# Altium schematic sheet percepcao_externa_sensores.SchDoc
size A4; SheetNumber: 4; SheetTotal: 4
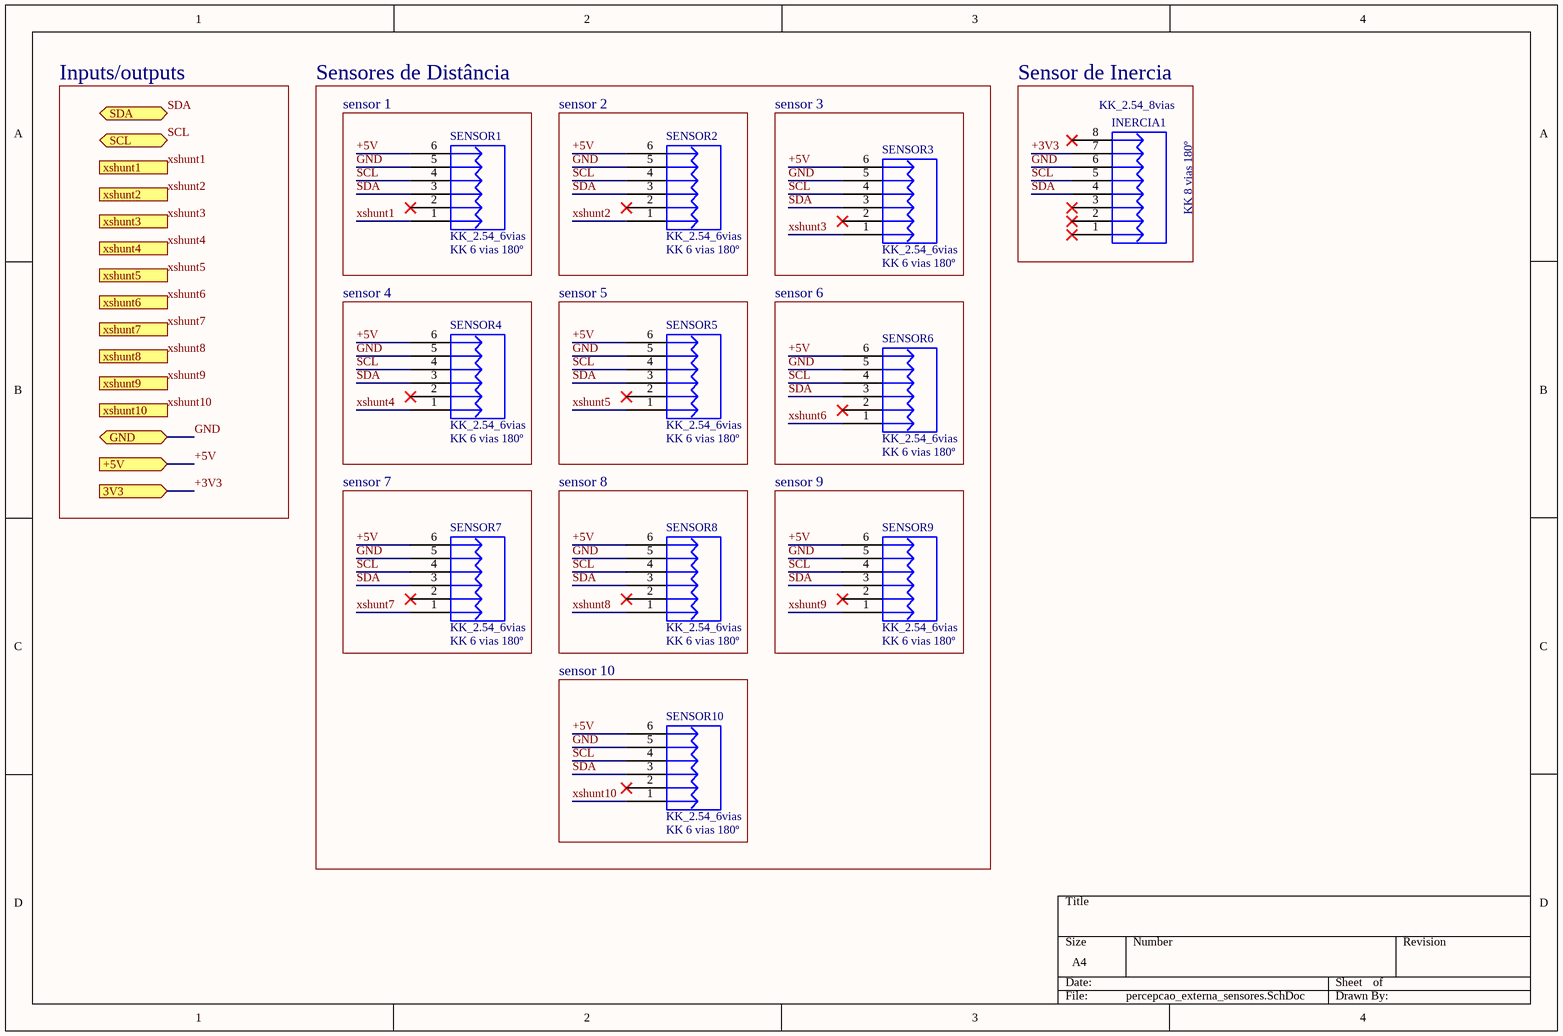
[diagram p0: percepcao_externa_sensores.SchDoc]

## Parts
INERCIA1  KK_2.54_8vias  Valor: KK 8 vias 180º  [KK_8vias_180°]
SENSOR1  KK_2.54_6vias  Valor: KK 6 vias 180º  [KK_6vias_180°]
SENSOR2  KK_2.54_6vias  Valor: KK 6 vias 180º  [KK_6vias_180°]
SENSOR3  KK_2.54_6vias  Valor: KK 6 vias 180º  [KK_6vias_180°]
SENSOR4  KK_2.54_6vias  Valor: KK 6 vias 180º  [KK_6vias_180°]
SENSOR5  KK_2.54_6vias  Valor: KK 6 vias 180º  [KK_6vias_180°]
SENSOR6  KK_2.54_6vias  Valor: KK 6 vias 180º  [KK_6vias_180°]
SENSOR7  KK_2.54_6vias  Valor: KK 6 vias 180º  [KK_6vias_180°]
SENSOR8  KK_2.54_6vias  Valor: KK 6 vias 180º  [KK_6vias_180°]
SENSOR9  KK_2.54_6vias  Valor: KK 6 vias 180º  [KK_6vias_180°]
SENSOR10  KK_2.54_6vias  Valor: KK 6 vias 180º  [KK_6vias_180°]

## Blocks framed on the sheet
Sensor de Inercia: INERCIA1
sensor 1: SENSOR1
sensor 2: SENSOR2
sensor 3: SENSOR3
sensor 4: SENSOR4
sensor 5: SENSOR5
sensor 6: SENSOR6
sensor 7: SENSOR7
sensor 8: SENSOR8
sensor 9: SENSOR9
sensor 10: SENSOR10

## Ports
3V3 (in), +5V (in), GND (bidir), SCL (bidir), SDA (bidir), xshunt1 (in), xshunt2 (in), xshunt3 (in), xshunt4 (in), xshunt5 (in), xshunt6 (in), xshunt7 (in), xshunt8 (in), xshunt9 (in), xshunt10 (in)

## Nets
+3V3: INERCIA1.7 ; port 3V3
+5V: SENSOR1.6 SENSOR2.6 SENSOR3.6 SENSOR4.6 SENSOR5.6 SENSOR6.6 SENSOR7.6 SENSOR8.6 SENSOR9.6 SENSOR10.6 ; port +5V
GND: INERCIA1.6 SENSOR1.5 SENSOR2.5 SENSOR3.5 SENSOR4.5 SENSOR5.5 SENSOR6.5 SENSOR7.5 SENSOR8.5 SENSOR9.5 SENSOR10.5 ; port GND
SCL: INERCIA1.5 SENSOR1.4 SENSOR2.4 SENSOR3.4 SENSOR4.4 SENSOR5.4 SENSOR6.4 SENSOR7.4 SENSOR8.4 SENSOR9.4 SENSOR10.4 ; port SCL
SDA: INERCIA1.4 SENSOR1.3 SENSOR2.3 SENSOR3.3 SENSOR4.3 SENSOR5.3 SENSOR6.3 SENSOR7.3 SENSOR8.3 SENSOR9.3 SENSOR10.3 ; port SDA
xshunt1: SENSOR1.1 ; port xshunt1
xshunt2: SENSOR2.1 ; port xshunt2
xshunt3: SENSOR3.1 ; port xshunt3
xshunt4: SENSOR4.1 ; port xshunt4
xshunt5: SENSOR5.1 ; port xshunt5
xshunt6: SENSOR6.1 ; port xshunt6
xshunt7: SENSOR7.1 ; port xshunt7
xshunt8: SENSOR8.1 ; port xshunt8
xshunt9: SENSOR9.1 ; port xshunt9
xshunt10: SENSOR10.1 ; port xshunt10

Not connected (* = marked no-connect by the designer): INERCIA1 1* 2* 3* 8*; SENSOR1 2*; SENSOR2 2*; SENSOR3 2*; SENSOR4 2*; SENSOR5 2*; SENSOR6 2*; SENSOR7 2*; SENSOR8 2*; SENSOR9 2*; SENSOR10 2*

## Notes on the sheet
- Inputs/outputs
- Sensores de Distância

## Library data of the parts
INERCIA1 = KK_2.54_8vias: Conector KK 2.54mm 8 vias; Descrição: Conector KK 3 vias com passo 2.54mm; Encapsulamento: PTH - 180º; Modelo: 3 vias - 180º; Marca: *; Observação: *
SENSOR1-SENSOR10 = KK_2.54_6vias: Conector KK 2.54mm 6 vias; Descrição: Conector KK 3 vias com passo 2.54mm; Encapsulamento: PTH - 180º; Modelo: 3 vias - 180º; Marca: *; Observação: *